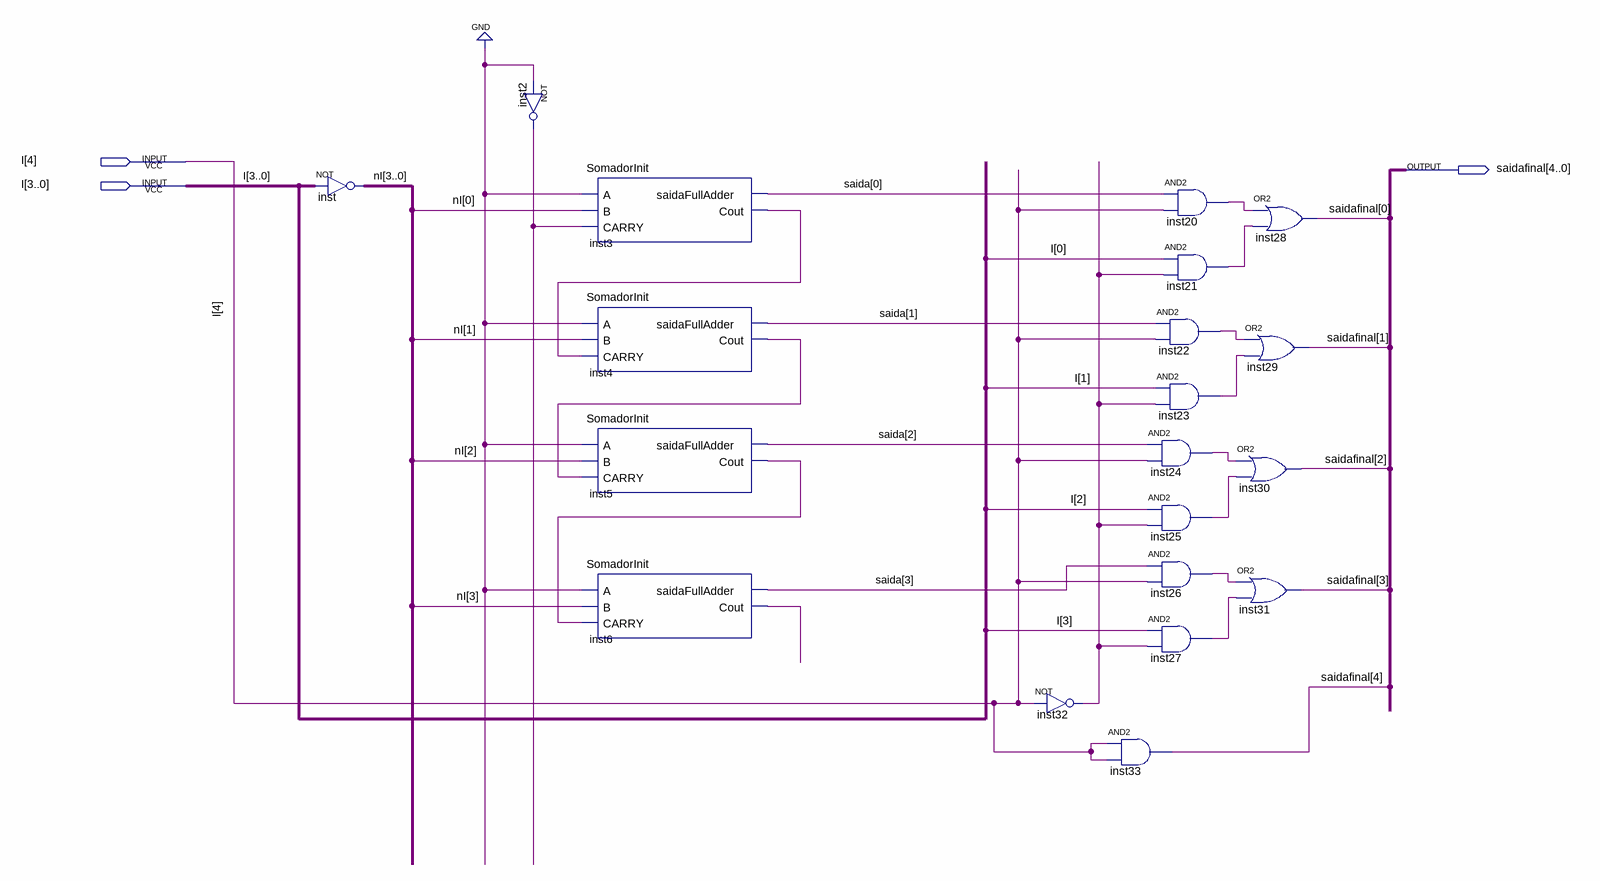
[diagram p0: schematic sheet]
// Quartus schematic comp2_repetindoentradaseforpositivo.bdf as structural Verilog: 20 symbols, 3 pins
module comp2_repetindoentradaseforpositivo (
  input  [4:0] I,
  output [4:0] saidafinal
);

  wire inst2_out, inst3_cout, inst4_cout, inst5_cout, inst6_cout, inst20_out, inst21_out, inst22_out,
       inst23_out, inst24_out, inst25_out, inst26_out, inst27_out, inst32_out;
  wire [3:0] nI, saida;

  assign nI = ~I[3:0];  // NOT inst, 4 bits wide
  not inst2 (inst2_out, 1'b0);
  SomadorInit inst3 (.A(1'b0), .B(nI[0]), .CARRY(inst2_out), .saidaFullAdder(saida[0]), .Cout(inst3_cout));
  SomadorInit inst4 (.A(1'b0), .B(nI[1]), .CARRY(inst3_cout), .saidaFullAdder(saida[1]), .Cout(inst4_cout));
  SomadorInit inst5 (.A(1'b0), .B(nI[2]), .CARRY(inst4_cout), .saidaFullAdder(saida[2]), .Cout(inst5_cout));
  SomadorInit inst6 (.A(1'b0), .B(nI[3]), .CARRY(inst5_cout), .saidaFullAdder(saida[3]), .Cout(inst6_cout));
  not inst32 (inst32_out, I[4]);
  and inst20 (inst20_out, saida[0], I[4]);
  and inst21 (inst21_out, I[0], inst32_out);
  and inst22 (inst22_out, saida[1], I[4]);
  and inst23 (inst23_out, I[1], inst32_out);
  and inst24 (inst24_out, saida[2], I[4]);
  and inst25 (inst25_out, I[2], inst32_out);
  and inst26 (inst26_out, saida[3], I[4]);
  and inst27 (inst27_out, I[3], inst32_out);
  and inst33 (saidafinal[4], I[4], I[4]);
  or inst28 (saidafinal[0], inst20_out, inst21_out);
  or inst29 (saidafinal[1], inst22_out, inst23_out);
  or inst30 (saidafinal[2], inst24_out, inst25_out);
  or inst31 (saidafinal[3], inst26_out, inst27_out);
endmodule
